# EAGLE design eRIC_breakout (EAGLE 7.2.0)
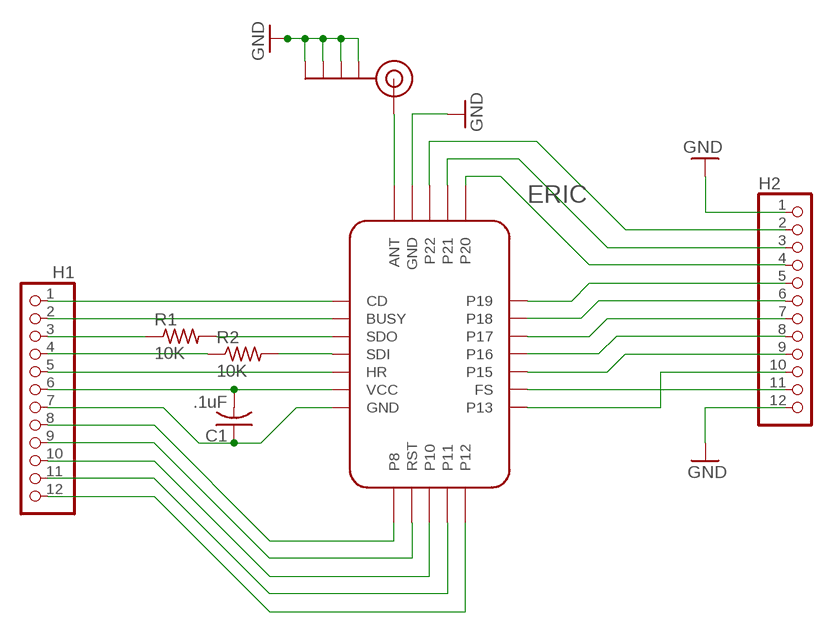
[diagram p0: schematic, sheet 1]

## Parts
C1  .1uF  C-USC0603K  [C0603K]
ERIC  ERIC  [ERIC]
H1  PINHD-1X12-CB  [1X12-CB]
H2  PINHD-1X12-CB  [1X12-CB]
J$1  SMA_EDGE  [SMA-EDGE]
R1  10K  R-US_R0603  [R0603]
R2  10K  R-US_R0603  [R0603]

## Nets
GND: C1.1 ERIC.AGND(GND) ERIC.GND H1.7 H2.1 H2.12 J$1.GND@0(GND) J$1.GND@1(GND) J$1.GND@2(GND) J$1.GND@3(GND)
N$1: ERIC.CD H1.1
N$2: ERIC.BUSY H1.2
N$3: ERIC.ANT J$1.SIG(SIGNAL)
N$8: ERIC.HR H1.5
N$11: ERIC.E8(P8) H1.8
N$12: ERIC.E9(RST) H1.9
N$13: ERIC.E10(P10) H1.10
N$14: ERIC.E11(P11) H1.11
N$15: ERIC.E12(P12) H1.12
N$16: ERIC.E15(P15) H2.9
N$17: ERIC.E16(P16) H2.8
N$18: ERIC.E17(P17) H2.7
N$19: ERIC.E18(P18) H2.6
N$20: ERIC.E19(P19) H2.5
N$21: ERIC.E20(P20) H2.4
N$22: ERIC.E21(P21) H2.3
N$23: ERIC.E22(P22) H2.2
N$24: ERIC.FS H2.11
N$25: ERIC.E13(P13) H2.10
SDI: ERIC.SDI H1.4 R2.1 R2.2
SDO: ERIC.SDO H1.3 R1.1 R1.2
VCC: C1.2 ERIC.VCC H1.6

## Library data of the parts
C1 = adafruit:C-US: CAPACITOR, American symbol
ERIC = lprs:ERIC: eRIC SoC Radio Transceiver VCC: -0.3 to +6.0V I/O: -0.3 to +3.3V Operating Temperature: -40°C to 85°C Antenna: 50V p-p @ < 10MHz by Low Power Radio Solutions ( http://www.lprs.co.uk )
H1 H2 = adafruit:PINHD-1X12: PIN HEADER
J$1 = SparkFun-Connectors:SMA_EDGE: SMA Antenna Connector End launch SMA connector. The paste layer has been removed so that the connector can be hand soldered onto the board after reflow.
R1 R2 = adafruit:R-US_: RESISTOR, American symbol

## Board
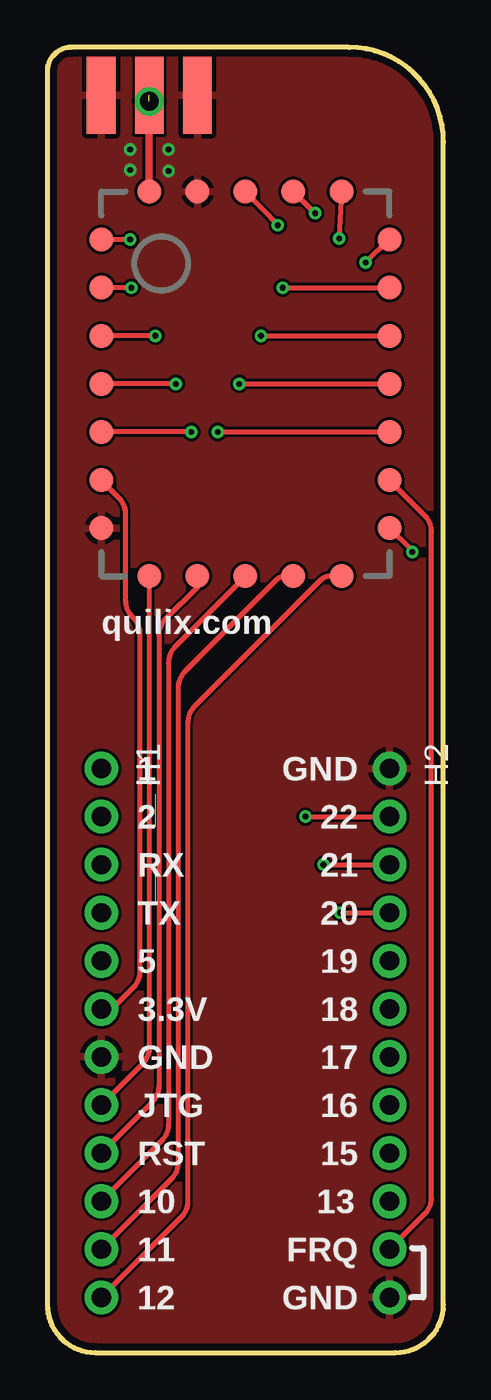
[diagram p1: board, top side]
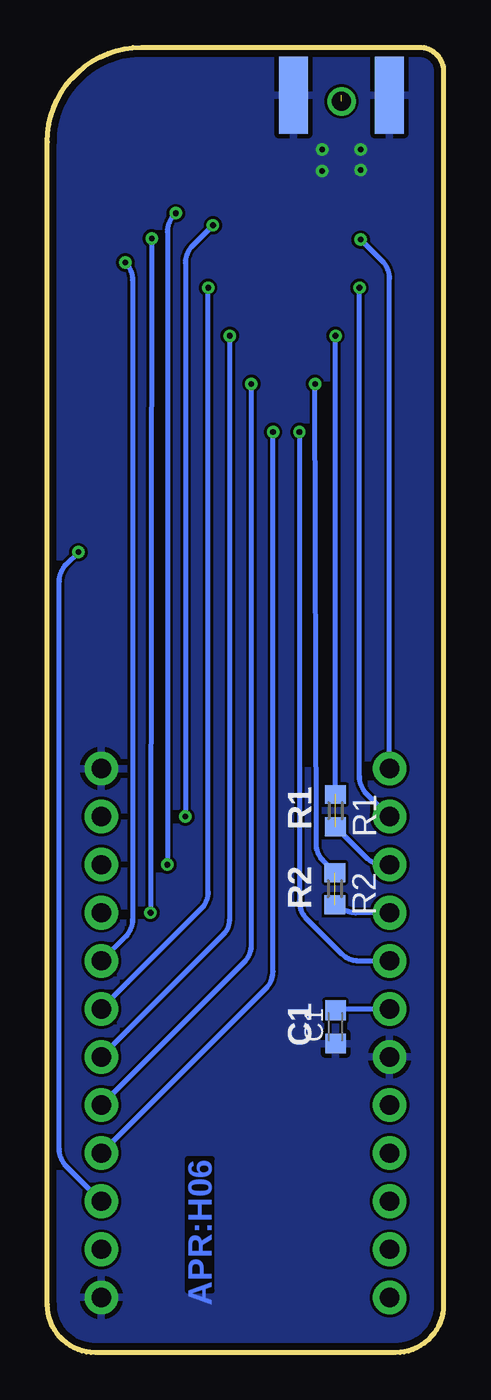
[diagram p2: board, bottom side, seen from below]

Size 20.96 x 68.96 mm. Coordinates in mm from the lower left corner, seen from the top.
Outline: 0,67.69 0,2.54 arc90 2.54,0 18.42,0 arc90 20.96,2.54 20.96,63.96 arc90 15.96,68.96 1.27,68.96 arc90 0,67.69
Copper layers (1*16): Top 0.0356mm / dielectric 1.5011mm / Bottom 0.0356mm
Design rules "eRIC_breakout *": minimum track width 6mil, minimum drill 13mil, track to track 6mil, track to pad 6mil, pad to pad 6mil, via to via 6mil, smd to smd 6mil, copper to edge 15mil, drill to drill 6mil, minimum pad ring 7mil, minimum via ring 7mil, stop-mask expansion 3mil, vias tented up to drill 0.3mm, thermal gap 10mil

### Footprints (pad centres in the part's own frame; a part is rotated, then mirrored left to right if it is on the bottom)
C0603K = smd 1.05 x 1.08: 1 -0.875,0; 2 0.875,0
ERIC = smd 1.27 x 1.27: AGND 5.08,20.32; ANT 2.54,20.32; BUSY 0,15.24; CD 0,17.78; E8 2.54,0; E9 5.08,0; E10 7.62,0; E11 10.16,0; E12 12.7,0; E13 15.24,2.54; E15 15.24,7.62; E16 15.24,10.16; E17 15.24,12.7; E18 15.24,15.24; E19 15.24,17.78; E20 12.7,20.32; E21 10.16,20.32; E22 7.62,20.32; FS 15.24,5.08; GND 0,2.54; HR 0,7.62; SDI 0,10.16; SDO 0,12.7; VCC 0,5.08
1X12-CB = drill 1.016 pad 1.778: 1 -13.97,0; 2 -11.43,0; 3 -8.89,0; 4 -6.35,0; 5 -3.81,0; 6 -1.27,0; 7 1.27,0; 8 3.81,0; 9 6.35,0; 10 8.89,0; 11 11.43,0; 12 13.97,0
SMA-EDGE = smd 1.524 x 4.064: GND@0 0,0; GND@1 5.08,0; SIG 2.54,0 | smd 1.524 x 4.064 bottom: GND@2 0,0; GND@3 5.08,0
R0603 = smd 1 x 1.1: 1 -0.85,0; 2 0.85,0

### Placement (x,y rotation side)
C1  5.71,17.21 90 bottom
ERIC  2.86,41.02 0 top
H1  2.86,16.89 270 top
H2  18.1,16.89 270 top
J$1  2.86,66.42 0 top
R1  5.71,28.64 270 bottom
R2  5.74,24.51 270 bottom

### Tracks (layer width: path | path; a pad name or v marks a point on that pad's centre or on a via)
GND  (via drill 0.3)
  other vias: 4.38,63.56 4.38,62.48 6.41,63.56 6.41,62.42
  pour Top: 20.96,63.96 20.96,2.54 arc-90 18.42,0 2.54,0 arc-90 0,2.54 0,67.69 arc-90 1.27,68.96 15.96,68.96 arc-90
  pour Bottom: 20.96,63.96 20.96,2.54 arc-90 18.42,0 2.54,0 arc-90 0,2.54 0,67.69 arc-90 1.27,68.96 15.96,68.96 arc-90
N$1  (via drill 0.3)
  Top 0.254: v4.38,58.8 ERIC.CD
  Bottom 0.254: H1.1 2.86,56.75 arc-45 3.23,57.65 v4.38,58.8
N$2  (via drill 0.3)
  Top 0.254: v4.45,56.26 ERIC.BUSY
  Bottom 0.254: H1.2 4.07,29.54 arc45 4.45,30.43 v4.45,56.26
N$3  (via drill 1)  (1 unrouted)
  Top 0.406: ERIC.ANT v5.4,66.1
N$8  (via drill 0.3)
  Top 0.254: v7.62,48.64 ERIC.HR
  Bottom 0.254: v7.62,48.64 7.62,23.83 arc-45 7.25,22.93 5.39,21.07 arc-45 4.49,20.7 H1.5
N$11
  Top 0.254: ERIC.E8 5.4,16.15 arc-45 5.03,15.25 H1.8
N$12
  Top 0.254: ERIC.E9 7.94,40.45 6.28,38.79 arc45 5.91,37.89 5.91,14.12 arc-45 5.53,13.22 H1.9
N$13
  Top 0.254: ERIC.E10 6.79,37.33 arc45 6.41,36.43 6.41,12.08 arc-45 6.04,11.19 H1.10
N$14
  Top 0.254: ERIC.E11 12.58,41.02 arc45 12.13,40.84 7.29,36 arc45 6.92,35.1 6.92,10.05 arc-45 6.55,9.15 H1.11
N$15
  Top 0.254: ERIC.E12 14.93,41.02 arc45 14.48,40.84 7.8,34.15 arc45 7.43,33.26 7.43,8.02 arc-45 7.06,7.12 H1.12
N$16  (via drill 0.3)
  Top 0.254: v9.02,48.64 ERIC.E15
  Bottom 0.254: H2.9 9.39,19.25 arc-45 9.02,20.15 v9.02,48.64
N$17  (via drill 0.3)
  Top 0.254: v10.16,51.18 ERIC.E16
  Bottom 0.254: H2.8 10.53,20.65 arc-45 10.16,21.54 v10.16,51.18
N$18  (via drill 0.3)
  Top 0.254: v11.3,53.72 ERIC.E17
  Bottom 0.254: H2.7 11.67,22.04 arc-45 11.3,22.94 v11.3,53.72
N$19  (via drill 0.3)
  Top 0.254: v12.45,56.26 ERIC.E18
  Bottom 0.254: H2.6 12.82,23.44 arc-45 12.45,24.34 v12.45,56.26
N$20  (via drill 0.3)
  Top 0.254: ERIC.E19 v16.83,57.59
  Bottom 0.254: v16.83,57.59 16.75,57.51 arc41 16.45,56.68 16.45,22.88 arc45 16.82,21.98 H2.5
N$21  (via drill 0.3)
  Top 0.254: ERIC.E20 v15.43,58.86 | v15.49,23.24 H2.4
  Bottom 0.254: v15.43,58.86 v15.49,23.24
N$22  (via drill 0.3)
  Top 0.254: ERIC.E21 v14.16,60.2 | v14.6,25.78 H2.3
  Bottom 0.254: v14.16,60.2 14.29,60.05 arc-41 14.6,59.21 v14.6,25.78
N$23  (via drill 0.3)
  Top 0.254: ERIC.E22 v12.19,59.56 | v13.65,28.32 H2.2
  Bottom 0.254: v12.19,59.56 13.28,58.47 arc-45 13.65,57.58 v13.65,28.32
N$24
  Top 0.254: H2.11 19.95,7.31 arc45 20.32,8.21 20.32,43.35 arc45 19.95,44.25 ERIC.FS
N$25  (via drill 0.3)
  Top 0.254: v19.3,42.29 19.3,42.35 ERIC.E13
  Bottom 0.254: H2.10 19.95,9.85 arc45 20.32,10.75 20.32,40.75 arc45 19.95,41.65 v19.3,42.29
SDI  (via drill 0.3)  (1 unrouted)
  Top 0.254: v6.79,51.18 ERIC.SDI
  Bottom 0.254: H1.4 4.65,23.24 arc29 5.26,23.4 R2.2 | R2.1 6.36,25.98 arc45 6.73,26.88 v6.79,51.18
SDO  (via drill 0.3)  (1 unrouted)
  Top 0.254: v5.71,53.72 ERIC.SDO
  Bottom 0.254: H1.3 3.18,25.78 arc45 4.08,26.15 R1.2 | R1.1 v5.71,53.72
VCC
  Top 0.254: ERIC.VCC 3.76,45.2 arc-45 4.13,44.3 4.13,39.77 arc45 4.5,38.87 4.52,38.85 arc-45 4.89,37.95 4.89,20.15 arc-45 4.52,19.25 3.43,18.16 H1.6
  Bottom 0.254: C1.2 5.64,18.16 H1.6

### Text on the board
Bottom: APR:H06
_tsilk: quilix.com | 1 | GND | 2 | 22 | RX | 21 | TX | 20 | 5 | 19 | 3.3V | 18 | GND | 17 | JTG | 16 | RST | 15 | 10 | 13 | 11 | FRQ | 12 | GND
_bsilk: R1 | R2 | C1